# EAGLE schematic Amplifiers (EAGLE 9.6.2)
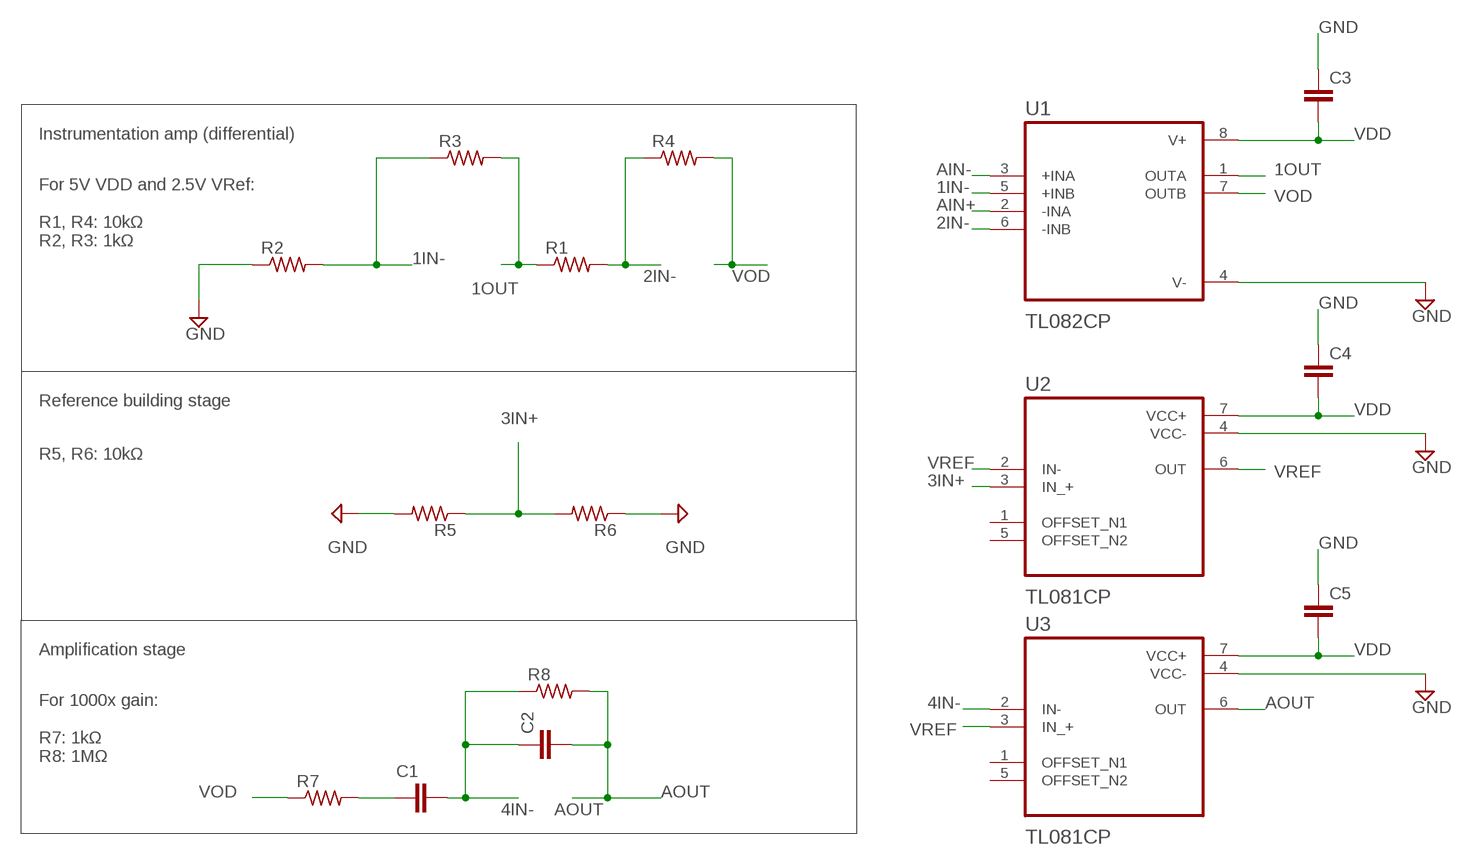
[diagram p0: schematic, sheet 1]

## Parts
C1  C2.5/2  [C2.5-2]
C2  C2.5/2  [C2.5-2]
C3  C2.5/2  [C2.5-2]
C4  C2.5/2  [C2.5-2]
C5  C2.5/2  [C2.5-2]
R1  R-US_0204/5  [0204/5]
R2  R-US_0204/5  [0204/5]
R3  R-US_0204/5  [0204/5]
R4  R-US_0204/5  [0204/5]
R5  R-US_0204/5  [0204/5]
R6  R-US_0204/5  [0204/5]
R7  R-US_0204/5  [0204/5]
R8  R-US_0204/5  [0204/5]
U1  TL082CP  [DIP794W45P254L959H508Q8]
U2  TL081CP  [DIP794W45P254L959H508Q8]
U3  TL081CP  [DIP794W45P254L959H508Q8]

## Nets
1IN-: R2.2 R3.1 U1.5(+INB)
1OUT: R1.1 R3.2 U1.1(OUTA)
2IN-: R1.2 R4.1 U1.6(-INB)
3IN+: R5.1 R6.2 U2.3(IN_+)
4IN-: C1.2 C2.1 R8.1 U3.2(IN-)
AIN+: U1.2(-INA)
AIN-: U1.3(+INA)
AOUT: C2.2 R8.2 U3.6(OUT)
GND: C3.1 C4.1 C5.1 R2.1 R5.2 R6.1
N$7: U3.4(VCC-)
N$8: U3.7(VCC+)
N$9: C1.1 R7.2
N$10: U2.4(VCC-)
N$11: U2.7(VCC+)
N$14: U1.8(V+)
N$15: U1.4(V-)
VDD: C3.2 C4.2 C5.2
VOD: R4.2 R7.1 U1.7(OUTB)
VREF: U2.2(IN-) U2.6(OUT) U3.3(IN_+)
Unconnected: U2.1(OFFSET_N1) U2.5(OFFSET_N2) U3.1(OFFSET_N1) U3.5(OFFSET_N2)

## Notes on the sheet
- Instrumentation amp (differential)
- For 5V VDD and 2.5V VRef:
  
  R1, R4: 10kΩ
  R2, R3: 1kΩ
- Reference building stage
- R5, R6: 10kΩ
- Amplification stage
- For 1000x gain:
  
  R7: 1kΩ
  R8: 1MΩ

## Library data of the parts
C1-C5 = capacitor-wima:C: CAPACITOR naming: grid - package width
R1-R8 = rcl:R-US_: RESISTOR, American symbol; SPICEPREFIX: R
U1 = TL082CP:TL082CP: Check availability <https://pricing.snapeda.com/parts/TL082CP/Texas%20Instruments/view-part?ref=eda>; AVAILABILITY: In Stock; CHECK_PRICES: https://www.snapeda.com/parts/TL082CP/Texas+Instruments/view-part/?ref=eda; DESCRIPTION: Dual, 30-V, 3-MHz, 13-V/µs slew rate, In to V+, JFET-input op amp; MF: Texas Instruments; MP: TL082CP; PACKAGE: PDIP-8 Texas; PRICE: None; PURCHASE-URL: https://www.snapeda.com/api/url_track_click_mouser/?unipart_id=854431&manufacturer=Texas Instruments&part_name=TL082CP&search_term=tl082; SNAPEDA_LINK: https://www.snapeda.com/parts/TL082CP/Texas+Instruments/view-part/?ref=snap
U2 U3 = TL081CP:TL081CP: Check availability <https://pricing.snapeda.com/parts/TL081CP/Texas%20Instruments/view-part?ref=eda>; AVAILABILITY: In Stock; CHECK_PRICES: https://www.snapeda.com/parts/TL081CP/Texas+Instruments/view-part/?ref=eda; DESCRIPTION: Single, 30-V, 3-MHz, 13-V/µs slew rate, In to V+, JFET-input op amp; MF: Texas Instruments; MP: TL081CP; PACKAGE: PDIP-8 Texas; PRICE: None; PURCHASE-URL: https://www.snapeda.com/api/url_track_click_mouser/?unipart_id=51607&manufacturer=Texas Instruments&part_name=TL081CP&search_term=tl081; SNAPEDA_LINK: https://www.snapeda.com/parts/TL081CP/Texas+Instruments/view-part/?ref=snap